# EasyEDA Pro project ProPrj_StarrySkyPi_2025-06-18.epro, board PCB1
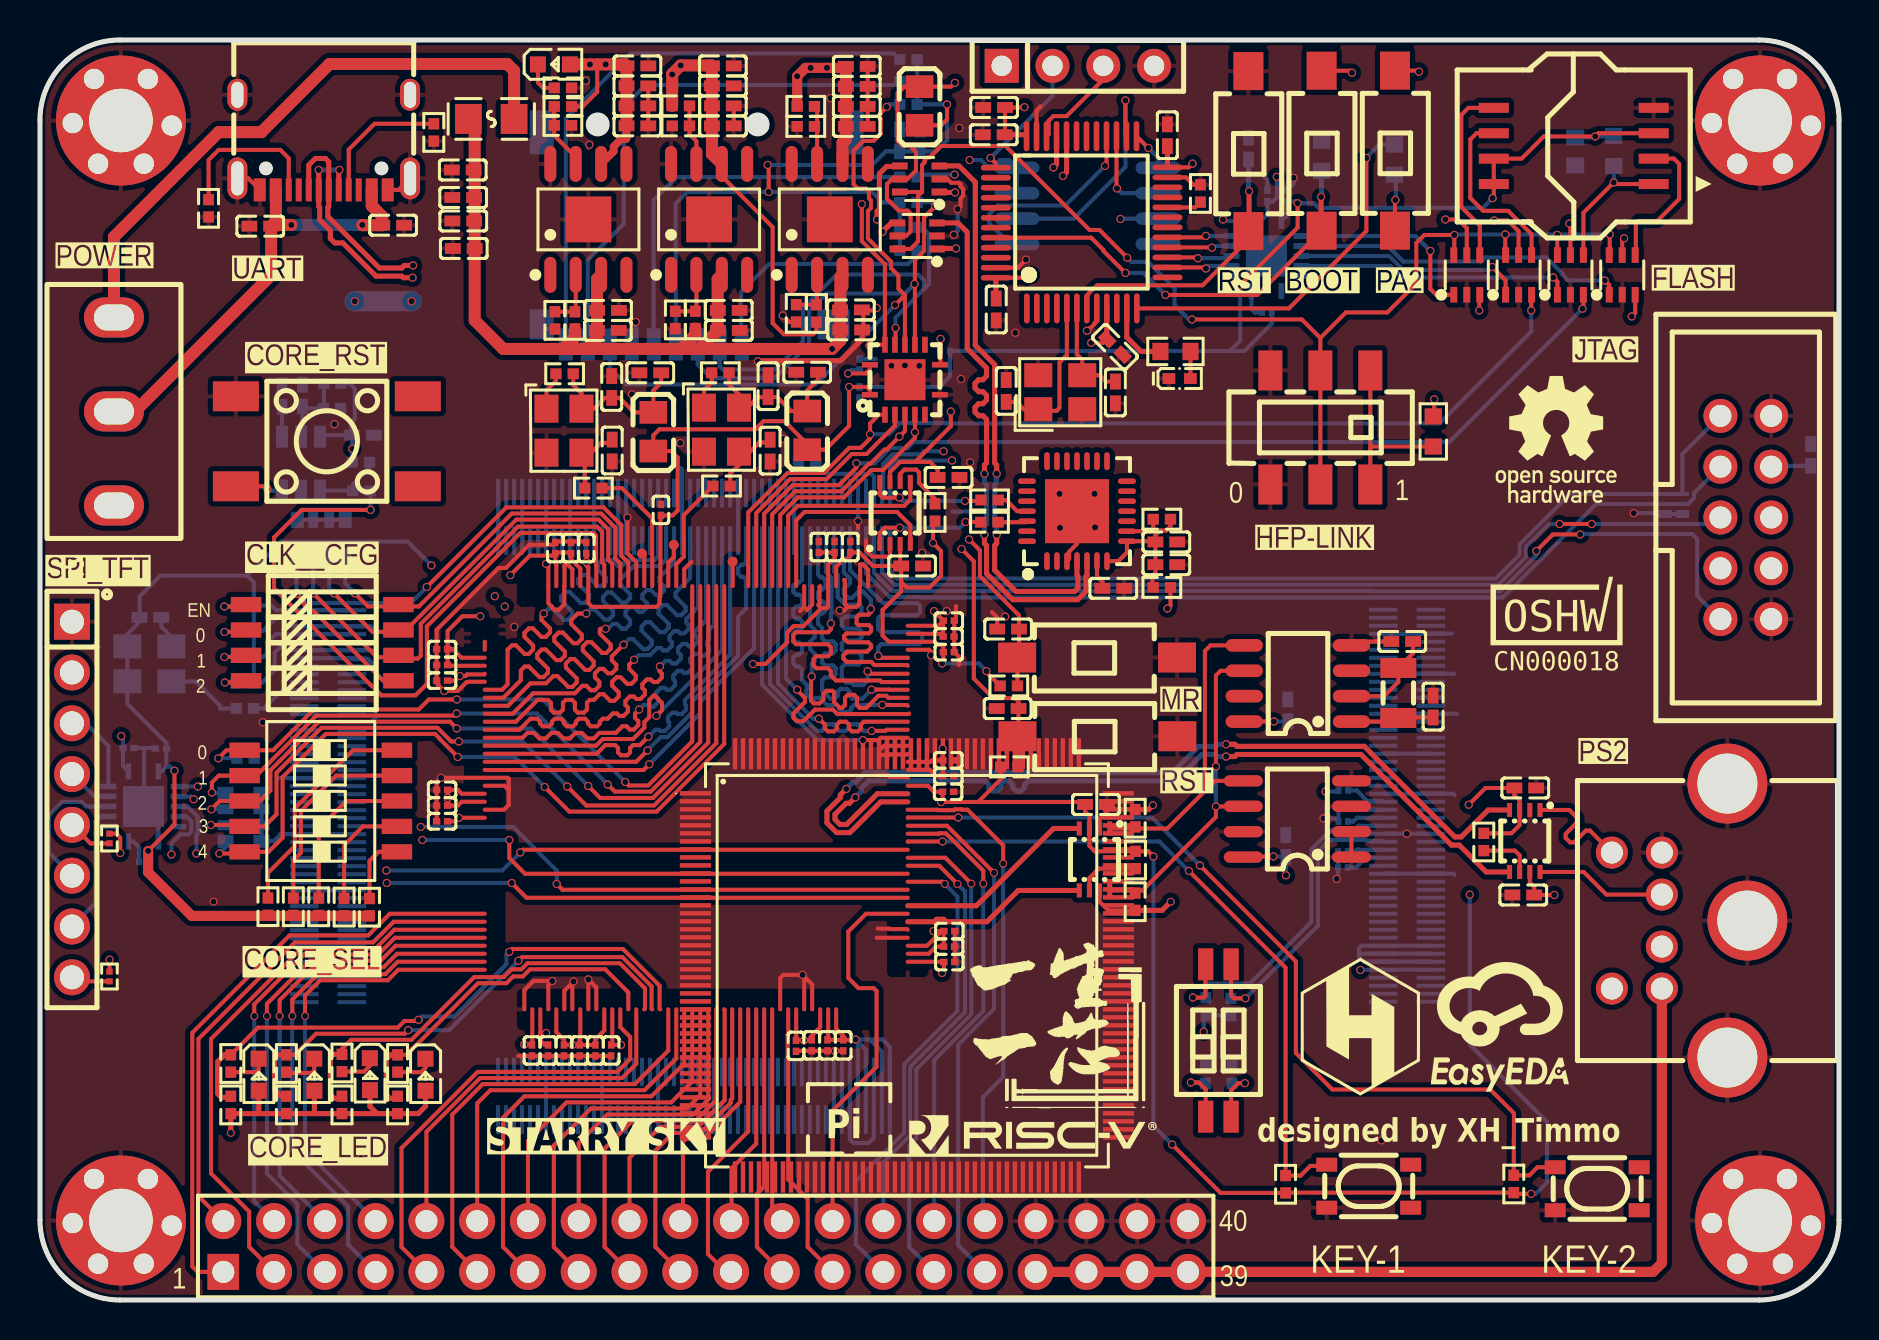
[diagram p7: board, top side]
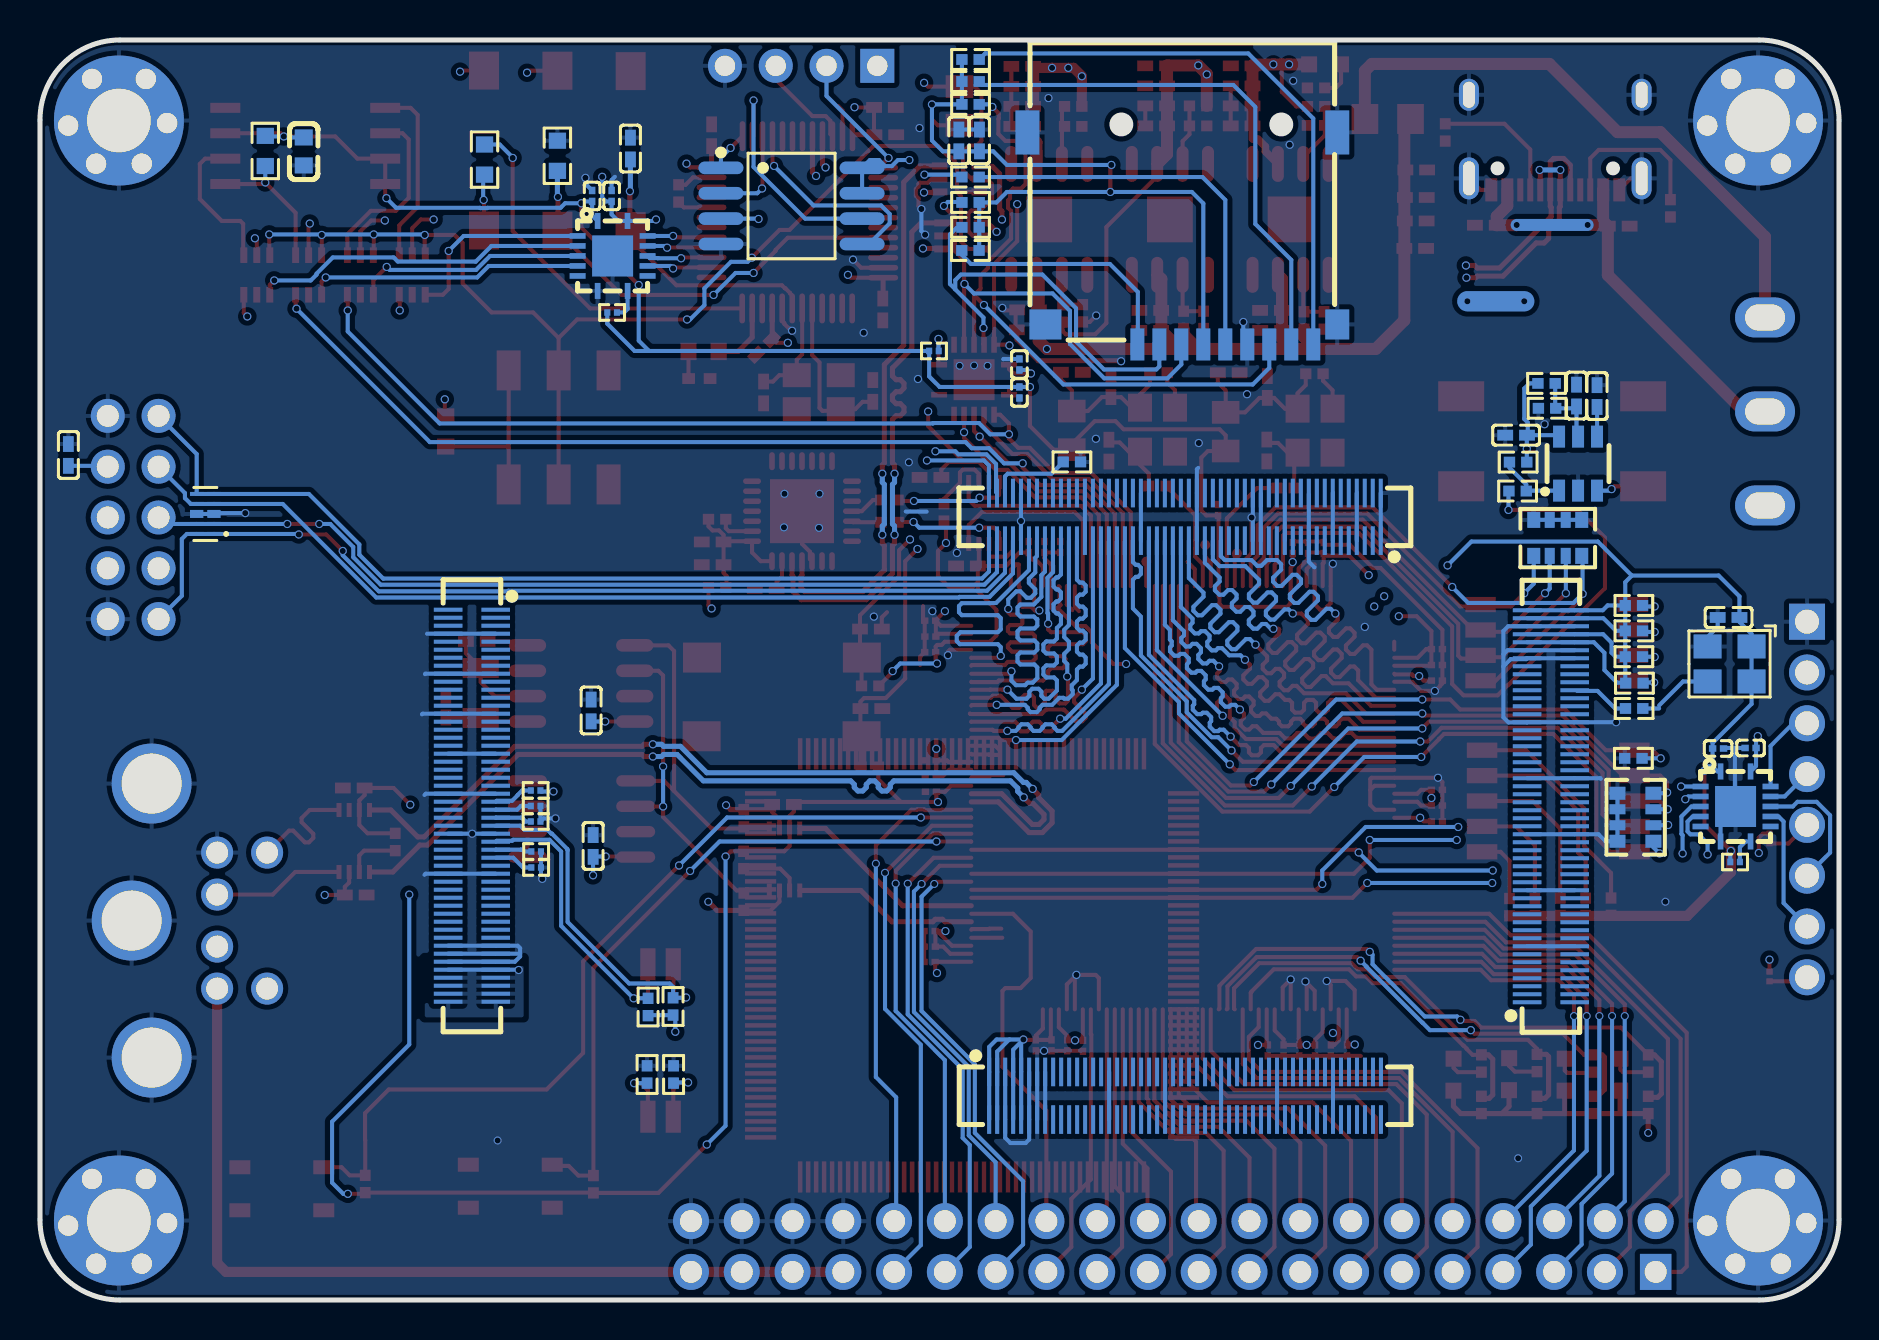
[diagram p8: board, bottom side, seen from below]

Outline 90 x 63 mm; copper layers: Top Layer, Inner2, Inner3, Bottom Layer. Coordinates in mm from the lower left corner of the outline.
Outline path: 0,59 0,4 arc(1.17,1.17) 4,0 86,0 arc(88.83,1.17) 90,4 90,59 arc(88.83,61.83) 86,63 4,63 arc(1.17,61.83) 0,59
Stack: Top Layer 0.035mm / Dielectric1 1.51mm FR4 er 4.5 / Inner2 0.035mm / Dielectric2 0.48mm PP er 4.5 / Inner3 0.035mm / Dielectric3 0.48mm PP er 4.5 / Bottom Layer 0.035mm

## Design rules (mm)
net UD+: DP1
net UD-: DP1
net B35_L23_P: CHIPLINK1
net B35_L21_N: CHIPLINK1
net B35_L21_P: CHIPLINK1
net B35_L19_P: CHIPLINK1
net B35_L20_P: CHIPLINK1
net B35_L19_N: CHIPLINK1
net B35_L1_N: CHIPLINK2
net B35_L2_N: CHIPLINK2
net B35_L25: CHIPLINK2
net FPGA_TMS: JTAG
net FPGA_TDI: JTAG
net FPGA_TDO: JTAG
net FPGA_TCK: JTAG
net B35_L24_N: CHIPLINK1
net B35_L24_P: CHIPLINK1
net B35_L14_N: CHIPLINK1
net B35_L6_P: CHIPLINK2
net B35_L2_P: CHIPLINK2
net B35_L6_N: CHIPLINK2
net B35_L4_P: CHIPLINK2
net B35_L14_P: CHIPLINK1
net B35_L20_N: CHIPLINK1
net B35_L1_P: CHIPLINK2
net B35_L5_N: CHIPLINK2
net B35_L4_N: CHIPLINK2
net B35_L5_P: CHIPLINK2
template: 自定义配置
spacing copperThickness1oz (default): track to track 0.102, other pairs 0.102 to 0.3
spacing copperThickness2oz: track to track 0.203, other pairs 0.152 to 0.3
track width copperThickness1oz (default): min 0.127, default 0.203, max 2.54
track width copperThickness2oz: min 0.203, default 0.254, max 2.54
track width POWER_1A: min 0.305, default 0.305, max 2.54
track width POWER_2A: min 0.508, default 0.508, max 2.54
differential pair differentialPair (default): width min 0.127, default 0.254, max 2.54; gap min 0.152, default 0.152
via viaSize (default): diameter min 0.399, default 0.399, max 10; hole min 0.3, default 0.3, max 6.299

## Placement (name value [footprint] x y rotation side)
C1  100nF  [C0402]  28.6 45.65 90 top
C2  100nF  [C0402]  30.53 46.36 180 top
C3  15pF  [C0402]  28.63 42.48 270 top
C4  100nF  [C0402]  43.63 36.7 0 top
C5  100nF  [C0402]  45.45 41.13 0 top
C6  100nF  [C0402]  40.86 58.68 180 top
C7  100nF  [C0402]  40.86 61.68 180 top
C8  10uF  [C0402]  40.86 59.68 180 top
C9  10uF  [C0402]  40.86 60.68 180 top
C10  100nF  [C0402]  29.89 58.71 180 top
C11  100nF  [C0402]  29.89 61.71 180 top
C12  10uF  [C0402]  29.89 60.71 180 top
C13  10uF  [C0402]  29.89 59.71 180 top
C14  1uF  [C0402]  40.59 48.51 180 top
C15  10uF  [C0402]  40.57 49.51 180 top
C16  1uF  [C0402]  28.42 49.48 180 top
C17  10uF  [C0402]  28.41 48.48 180 top
C18  10uF  [C0402]  17.67 53.74 0 top
C19  10uF  [C0402]  21.2 52.58 0 top
C20  10uF  [C0402]  21.17 55.12 0 top
C21  100nF  [C0402]  21.18 53.95 0 top
C22  100nF  [C0402]  21.15 56.5 0 top
C23  1uF  [C0402]  56.35 37.9 0 top
C24  100nF  [C0402]  56.35 36.77 0 top
C25  100nF  [C0402]  53.69 35.58 0 top
C26  100nF  [C0402]  34.16 61.71 180 top
C27  100nF  [C0402]  34.16 58.71 180 top
C28  10uF  [C0402]  34.16 60.71 180 top
C29  10uF  [C0402]  34.16 59.71 180 top
C30  1uF  [C0402]  34.46 49.48 180 top
C31  10uF  [C0402]  34.46 48.48 180 top
C32  10uF  [C0402]  11.02 53.69 180 top
C33  100nF  [C0402]  38.38 46.39 0 top
C34  100nF  [C0402]  36.42 45.69 270 top
C35  15pF  [C0402]  36.53 42.47 90 top
C36  100nF  [C0201]  45.47 32.39 180 top
C37  100nF  [C0201]  28.58 12.48 90 top
C38  100nF  [C0201]  40.54 37.65 270 top
C39  100nF  [C0201]  39.4 12.73 90 top
C40  100nF  [C0201]  31.06 39.5 270 top
C41  100nF  [C0201]  40.18 12.73 90 top
C42  100nF  [C0201]  20.12 30.97 0 top
C43  100nF  [C0201]  45.49 16.9 180 top
C44  100nF  [C0201]  20.12 23.93 0 top
C45  100nF  [C0201]  45.43 25.41 180 top
C46  100nF  [C0201]  27.33 37.6 270 top
C47  100nF  [C0201]  25.42 12.48 90 top
C48  22nF  [C0402]  12.1 45.2 270 bottom
C49  100nF  [C0402]  16.15 43.24 180 bottom
C50  10nF  [C0402]  13.13 45.22 270 bottom
C51  100nF  [C0201]  45.44 26.19 180 top
C52  100nF  [C0201]  26.21 12.48 90 top
C53  100nF  [C0201]  45.47 33.97 180 top
C54  100nF  [C0201]  20.12 31.75 0 top
C55  100nF  [C0201]  45.46 33.17 180 top
C56  100nF  [C0201]  45.49 18.45 180 top
C57  100nF  [C0201]  39.75 37.65 270 top
C58  100nF  [C0201]  45.48 17.67 180 top
C59  100nF  [C0201]  38.96 37.65 270 top
C60  100nF  [C0201]  38.61 12.73 90 top
C61  100nF  [C0201]  25.78 37.6 270 top
C62  100nF  [C0201]  37.82 12.71 90 top
C63  100nF  [C0201]  27 12.48 90 top
C64  100nF  [C0201]  20.12 25.51 0 top
C65  100nF  [C0201]  24.61 12.48 90 top
C66  100nF  [C0201]  20.12 24.72 0 top
C67  100nF  [C0201]  26.57 37.6 270 top
C68  100nF  [C0201]  27.79 12.48 90 top
C69  100nF  [C0201]  20.12 32.54 0 top
C70  100nF  [C0201]  45.44 26.98 180 top
C74  100nF  [C0603]  76.8 57.43 90 bottom
C84  100nF  [C0402]  48.43 33.55 180 top
C85  100nF  [C0402]  5.53 34.13 0 bottom
C86  100nF  [C0402]  48.41 29.57 180 top
C87  100nF  [C0402]  88.58 42.25 270 bottom
C88  100nF  [C0402]  56.4 58.24 90 top
C89  12pF  [C0402]  53.8 45.38 90 top
C90  12pF  [C0402]  48.34 45.45 270 top
C91  100nF  [C0402]  47.71 58.26 0 top
C93  100nF  [C0402]  53.78 47.65 315 top
C94  100nF  [C0402]  47.84 49.53 270 top
C96  100nF  [C0402]  60.46 57.57 90 bottom
C97  100nF  [C0402]  47.73 59.63 180 top
C100  100nF  [C0402]  43 57.98 90 bottom
C101  10uF  [C0402]  44.03 57.98 90 bottom
C102  100nF  [C0402]  74.3 25.6 180 top
C103  100nF  [C0402]  74.2 20.25 0 top
C104  100nF  [C0402]  62.33 22.7 270 bottom
C105  100nF  [C0402]  62.43 29.48 90 bottom
C106  12pF  [C0402]  69.69 29.67 270 top
C107  12pF  [C0402]  68.15 32.92 0 top
C108  100nF  [C0201]  6.05 27.58 180 bottom
C109  100nF  [C0201]  4.43 27.6 0 bottom
C110  100nF  [C0402]  52.83 24.78 180 top
C111  100nF  [C0201]  62.38 55.2 90 bottom
C112  100nF  [C0201]  61.4 55.2 90 bottom
C113  100nF  [C0201]  41 45.38 270 bottom
C114  100nF  [C0201]  41 46.78 90 bottom
CARD2  XKTF-015-N  [TF-SMD_XKTF-015-N]  32.85 53.08 0 bottom
CN1  GT-B0403FSV14-100B1101  [CONN-SMD_100P-P0.40_GT-B0403FSV24-100B1101]  32.51 38.95 270 bottom
CN2  GT-B0403FSV14-100B1101  [CONN-SMD_100P-P0.40_GT-B0403FSV24-100B1101]  32.93 10.43 90 bottom
CN5  GT-B0403FSV14-100B1101  [CONN-SMD_100P-P0.40_GT-B0403FSV24-100B1101]  14.63 24.48 0 bottom
CN6  GT-B0403FSV14-100B1101  [CONN-SMD_100P-P0.40_GT-B0403FSV24-100B1101]  68.18 24.93 180 bottom
D2  RCLAMP0524P  [DFN2510-10_L2.5-W1.0-P0.50-BL]  81.73 39.3 90 bottom
H1  -  [HDR-TH_4P-P2.54-V-F]  51.92 61.71 0 top
H2  2.54-1*8P母环保  [HDR-TH_8P-P2.54-V-F-1]  1.6 25.03 270 top
L1  CBW201209U601T  [L0805]  30.68 43.42 90 top
L2  CBW201209U601T  [L0805]  38.38 43.48 90 top
L3  CBW201209U601T  [L0805]  44 59.7 90 top
LED1  KT-0603R  [LED0603-RD]  25.71 61.78 0 top
LED4  SZYY0402B  [LED0402-RD_BLUE]  57.01 46.07 0 top
LED9  19-213/Y2C-CQ2R2L/3T(CY)  [LED0603-RD-YELLOW]  19.29 11.27 270 top
LED10  19-213/Y2C-CQ2R2L/3T(CY)  [LED0603-RD-YELLOW]  16.5 11.29 270 top
LED11  19-213/Y2C-CQ2R2L/3T(CY)  [LED0603-RD-YELLOW]  13.72 11.27 270 top
LED12  19-213/Y2C-CQ2R2L/3T(CY)  [LED0603-RD-YELLOW]  10.94 11.27 270 top
OSC1  12.288MHz  [OSC-SMD_4P-L3.2-W2.5-BL]  34.09 43.52 270 top
OSC5  50MHz  [OSC-SMD_4P-L3.2-W2.5-BL]  5.48 31.8 0 bottom
PS1  DS1093-01-PN60  [CONN-TH_DS1093-01-PN60]  82.02 18.97 90 top
R1  4.7kΩ  [R0402]  26.25 46.31 180 top
R2  33Ω  [R0402]  27.69 40.6 0 top
R3  33Ω  [R0402]  34.09 40.7 180 top
R4  4.7kΩ  [R0402]  34.04 46.36 180 top
R5  NC  [R0402]  37.84 49.34 270 top
R6  8.06kΩ  [R0402]  38.31 59.68 0 top
R7  NC  [R0402]  25.76 48.98 270 top
R8  56kΩ  [R0402]  26.16 59.68 180 top
R9  1kΩ  [R0402]  38.84 49.33 270 top
R10  NC  [R0402]  26.76 48.98 270 top
R11  4.7kΩ  [R0402]  44.78 39.38 90 top
R12  10kΩ  [R0402]  38.31 58.68 180 top
R13  10kΩ  [R0402]  26.16 58.73 0 top
R14  0Ω  [R0402]  47.5 38.89 180 top
R15  0Ω  [R0402]  47.51 40 180 top
R16  NC  [R0402]  31.79 49.01 270 top
R17  26.1kΩ  [R0402]  32.06 59.71 0 top
R18  5.1kΩ  [R0402]  8.43 54.58 270 top
R19  NC  [R0402]  32.79 49.01 270 top
R20  10kΩ  [R0402]  32.06 58.71 180 top
R21  5.1kΩ  [R0402]  19.7 58.38 270 top
R22  4.7kΩ  [R0402]  26.16 60.61 180 top
R24  0Ω  [R0402]  56.12 35.63 180 top
R25  4.7kΩ  [R0402]  56.12 39.04 180 top
R26  150Ω  [R0402]  10.26 34.73 0 bottom
R27  150Ω  [R0402]  10.26 33.46 0 bottom
R28  10kΩ  [R0603]  78.73 57.45 90 bottom
R29  150Ω  [R0402]  10.26 32.16 0 bottom
R30  150Ω  [R0402]  10.24 30.84 0 bottom
R31  150Ω  [R0402]  12.67 19.66 270 top
R32  150Ω  [R0402]  13.94 19.66 270 top
R33  150Ω  [R0402]  15.22 19.65 270 top
R34  150Ω  [R0402]  16.48 19.64 270 top
R35  150Ω  [R0402]  11.41 19.67 270 top
R36  10kΩ  [R0402]  10.29 27.08 0 bottom
R37  14kΩ  [R0402]  14.63 45.83 180 bottom
R38  4.7kΩ  [R0402]  16.05 41.89 0 bottom
R39  10kΩ  [R0402]  14.61 44.59 0 bottom
R40  0Ω  [R0402]  16.08 40.45 180 bottom
R125  0Ω  [R0402]  38.38 41.9 180 bottom
R126  33Ω  [R0402]  10.25 29.58 0 bottom
R129  NC  [R0402]  48.47 30.71 180 top
R130  20kΩ  [R0201]  65.2 25.48 0 bottom
R131  20kΩ  [R0201]  65.2 24.7 0 bottom
R132  20kΩ  [R0201]  65.2 23.93 0 bottom
R133  20kΩ  [R0201]  65.18 22.43 0 bottom
R134  20kΩ  [R0201]  65.18 21.63 0 bottom
R135  150Ω  [R0402]  58.33 14.68 270 bottom
R136  150Ω  [R0402]  59.58 14.65 270 bottom
R137  20kΩ  [R0402]  58.3 11.28 90 bottom
R138  20kΩ  [R0402]  59.63 11.28 90 bottom
R148  NC  [R0402]  48.49 26.66 180 top
R153  4.7kΩ  [R0603]  56.8 47.43 180 top
R154  10kΩ  [R0402]  58.05 55.33 270 top
R157  10kΩ  [R0603]  64.11 57.21 270 bottom
R158  330Ω  [R0603]  67.76 57.02 90 bottom
R160  4.7kΩ  [R0603]  69.7 43.43 270 top
R161  33Ω  [R0402]  43.45 56.15 0 bottom
R162  4.7kΩ  [R0402]  43.45 62.03 0 bottom
R163  4.7kΩ  [R0402]  43.45 60.92 0 bottom
R164  4.7kΩ  [R0402]  43.45 59.78 0 bottom
R165  4.7kΩ  [R0402]  43.45 54.88 180 bottom
R166  4.7kΩ  [R0402]  43.45 53.63 180 bottom
R167  4.7kΩ  [R0402]  43.45 52.48 180 bottom
R168  4.7kΩ  [R0402]  72.23 22.9 270 top
R169  4.7kΩ  [R0201]  5.2 21.9 0 bottom
R170  4.7kΩ  [R0402]  54.8 22 270 top
R172  4.7kΩ  [R0402]  73.73 5.8 270 top
R173  4.7kΩ  [R0402]  62.31 5.79 270 top
R174  4.7kΩ  [R0402]  17.89 11.83 270 top
R175  4.7kΩ  [R0402]  15.11 11.85 270 top
R176  4.7kΩ  [R0402]  12.33 11.83 270 top
R177  4.7kΩ  [R0402]  9.55 11.83 270 top
R178  4.7kΩ  [R0201]  3.48 23.08 90 top
R179  4.7kΩ  [R0201]  3.48 16.18 90 top
R180  4.7kΩ  [R0201]  61.38 49.38 0 bottom
R181  4.7kΩ  [R0201]  45.28 47.45 0 bottom
R182  4.7kΩ  [R0402]  17.89 9.75 270 top
R183  4.7kΩ  [R0402]  15.11 9.75 270 top
R184  4.7kΩ  [R0402]  12.33 9.75 270 top
R185  4.7kΩ  [R0402]  9.55 9.75 270 top
R186  4.7kΩ  [R0402]  54.79 24.09 90 top
R187  4.7kΩ  [R0402]  54.79 19.91 270 top
RN1  10kΩ  [RES-ARRAY-SMD_0603-8P-L3.2-W1.6-BL]  14.07 38.11 0 bottom
RN2  10kΩ  [RES-ARRAY-SMD_0603-8P-L3.2-W1.6-BL]  10.19 24.14 270 bottom
S2  M3  [m3 125x300]  4.05 3.97 0 top
S3  M3  [m3 125x300]  4.05 58.97 0 top
S4  M3  [m3 125x300]  86.05 58.97 0 top
S5  M3  [m3 125x300]  86.05 3.97 0 top
SW3  KH-6X6X5H-STM  [SW-SMD_4P-L6.0-W6.0-P4.50-LS9.0-2]  14.35 42.94 0 top
SW5  PTS810SJM250SMTRLFS  [KEY-SMD_4P-L4.2-W3.2-P2.20-LS4.6]  77.9 5.56 180 top
SW9  SS-12D10L5  [SW-TH_SS-12D10L5]  3.7 44.43 90 top
SW12  TS-1101-C-W  [SW-SMD_L6.0-W3.3-LS8.0]  52.88 32.12 0 top
SW13  TS-1101-C-W  [SW-SMD_L6.0-W3.3-LS8.0]  52.9 28.19 0 top
SW14  TS-1101-C-W  [SW-SMD_L6.0-W3.3-LS8.0]  64.11 57.47 90 top
SW15  TS-1101-C-W  [SW-SMD_L6.0-W3.3-LS8.0]  60.45 57.45 90 top
SW16  TS-1101-C-W  [SW-SMD_L6.0-W3.3-LS8.0]  67.79 57.47 90 top
SW17  MST22D18G2 125  [SW-SMD_MST22D18G2]  64.05 43.63 180 top
SW21  DSHP02TS-S  [SW-SMD_DSHP02TS-S]  58.95 12.98 0 top
SW22  PTS810SJM250SMTRLFS  [KEY-SMD_4P-L4.2-W3.2-P2.20-LS4.6]  66.47 5.69 180 top
TP1  -  [Test-Point-0.5mm]  30.12 37.32 0 top
TP2  -  [Test-Point-0.5mm]  31.71 37.76 0 top
TP3  -  [Test-Point-0.5mm]  34.65 36.92 0 top
U1  -  [LQPF 176 20*20]  32.79 25.33 0 top
U2  TXS0102DCUR  [VSON8_L2.0-W2.3-P0.50-LS3.1-BL]  74.28 22.95 180 top
U3  TPS3808G01DBVR  [SOT-23-6_L2.9-W1.6-P0.95-LS2.8-BR]  13.06 41.82 270 bottom
U6  TXS0102DCUR  [VSON8_L2.0-W2.3-P0.50-LS3.1-BL]  42.78 39.35 0 top
U7  RT2515HGSP  [SOP-8_L4.9-W3.9-P1.27-LS6.0-BL-EP]  39.51 54.03 0 top
U8  RT2515HGSP  [SOP-8_L4.9-W3.9-P1.27-LS6.0-BL-EP]  27.44 54.03 0 top
U9  CP2102-GMR  [WQFN-28_L5.0-W5.0-P0.50-BL-EP3.2]  51.88 39.44 0 top
U10  RT2515HGSP  [SOP-8_L4.9-W3.9-P1.27-LS6.0-BL-EP]  33.47 54.03 0 top
U11  SMD0805B050TF  [F0805]  22.58 59.05 180 top
U12  ACA-SPI-004-K02  [CONN-SMD_ACA-SPI-004-K02]  76.73 57.7 270 top
U16  GPHA204-0502A001A1AC  [HDR-TH_10P-P2.54-V-F-R2-C5-S2.54_GREENCONN]  85.34 39.13 270 top
U17  CH32V103C8T6  [LQFP-48_48P-L7.0-W7.0-P0.50-LS9.0-BL]  52.11 53.89 0 top
U18  W25Q128JVSIQ  [SOIC-8_L5.3-W5.3-P1.27-LS8.0-BL]  52.4 54.7 270 bottom
U19  WAS3157B-6/TR  [SOT-363_L2.0-W1.3-P0.65-LS2.1-BL]  76.56 51.25 0 top
U20  WAS3157B-6/TR  [SOT-363_L2.0-W1.3-P0.65-LS2.1-BL]  73.97 51.25 0 top
U21  WAS3157B-6/TR  [SOT-363_L2.0-W1.3-P0.65-LS2.1-BL]  79.15 51.25 0 top
U22  WAS3157B-6/TR  [SOT-363_L2.0-W1.3-P0.65-LS2.1-BL]  71.38 51.25 0 top
U24  WAS3157B-6/TR  [SOT-363_L2.0-W1.3-P0.65-LS2.1-BL]  44 56.05 90 top
U25  WAS3157B-6/TR  [SOT-363_L2.0-W1.3-P0.65-LS2.1-BL]  43.88 53.2 90 top
U26  AT24C64D-SSHM-T  [SOIC-8_L5.0-W4.0-P1.27-LS6.0-BL]  62.9 24.05 90 top
U27  PCF8563BM/TR  [SOP-8_L4.9-W3.9-P1.27-LS6.0-BL]  62.93 30.83 90 top
U29  TXS0102DCUR  [VSON8_L2.0-W2.3-P0.50-LS3.1-BL]  52.75 22.03 180 top
U33  PZ2.54-2*20  [HDR-TH_40P-P2.54-V-M-R2-C20-S2.54]  33.3 2.68 0 top
U34  DSHP05TSGER  [SW-SMD_10P-P1.27-L7.8-W5.4]  14.05 24.95 270 top
U37  TXS0104ERGYR  [VQFN-14_L3.5-W3.5-P0.50-BL-EP]  43.27 46.01 0 top
U38  TXS0104ERGYR  [VQFN-14_L3.5-W3.5-P0.50-BL-EP]  61.35 52.2 270 bottom
U39  TXS0104ERGYR  [VQFN-14_L3.5-W3.5-P0.50-BL-EP]  5.18 24.68 270 bottom
U40  DSHP04TSGER  [SW-SMD_8P-L6.7-W5.4-P1.27-LS8.4]  14.12 32.87 270 top
UART1  -  [USB-C-SMD_G-SWITCH_GT-USB-7010EN]  14.19 57.88 180 top
X1  25MHz  [OSC-SMD_4P-L3.2-W2.5-BL]  26.21 43.47 270 top
X2  8MHz  [CRYSTAL-SMD_4P-L3.2-W2.5-BL]  51.04 45.39 0 top
X3  32.768kHz  [FC-135R_L3.2-W1.5]  67.95 30.35 270 top

## Footprints (pads in the part's own frame, mm; a bottom-side part is the same pattern mirrored in y, then rotated)
C0201
  rect 0.368x0.324 smd: 1(-0.275,0) 2(0.275,0)
C0402
  rect 0.79x0.54 smd: 1(-0.545,0) 2(0.545,0)
C0603
  rect 0.8x0.9 smd: 1(-0.7,0) 2(0.7,0)
CONN-SMD_100P-P0.40_GT-B0403FSV24-100B1101
  rect 1.43x0.2 smd: 1(0.978,9.588) 2(0.978,9.188) 3(0.978,8.787) 4(0.978,8.388) 5(0.978,7.988) 6(0.978,7.588) 7(0.978,7.188) 8(0.978,6.787) 9(0.978,6.388) 10(0.978,5.987) 11(0.978,5.588) 12(0.978,5.188) 13(0.978,4.787) 14(0.978,4.388) 15(0.978,3.988) 16(0.978,3.587) 17(0.978,3.188) 18(0.978,2.788) 19(0.978,2.388) 20(0.978,1.988) 21(0.978,1.587) 22(0.978,1.188) 23(0.978,0.787) 24(0.978,0.388) 25(0.978,-0.012) 26(0.978,-0.412) 27(0.978,-0.812) 28(0.978,-1.212) 29(0.978,-1.612) 30(0.978,-2.012) 31(0.978,-2.413) 32(0.978,-2.812) 33(0.978,-3.212) 34(0.978,-3.612) 35(0.978,-4.012) 36(0.978,-4.412) 37(0.978,-4.812) 38(0.978,-5.213) 39(0.978,-5.612) 40(0.978,-6.012) 41(0.978,-6.412) 42(0.978,-6.812) 43(0.978,-7.213) 44(0.978,-7.612) 45(0.978,-8.012) 46(0.978,-8.412) 47(0.978,-8.812) 48(0.978,-9.213) 49(0.978,-9.612) 50(0.978,-10.012) 51(-1.403,-10.012) 52(-1.403,-9.612) 53(-1.403,-9.213) 54(-1.403,-8.812) 55(-1.403,-8.412) 56(-1.403,-8.012) 57(-1.403,-7.612) 58(-1.403,-7.213) 59(-1.403,-6.812) 60(-1.403,-6.412) 61(-1.403,-6.012) 62(-1.403,-5.612) 63(-1.403,-5.213) 64(-1.403,-4.812) 65(-1.403,-4.412) 66(-1.403,-4.012) 67(-1.403,-3.612) 68(-1.403,-3.212) 69(-1.403,-2.812) 70(-1.403,-2.413) 71(-1.403,-2.012) 72(-1.403,-1.612) 73(-1.403,-1.212) 74(-1.403,-0.812) 75(-1.403,-0.412) 76(-1.403,-0.012) 77(-1.403,0.388) 78(-1.403,0.787) 79(-1.403,1.188) 80(-1.403,1.587) 81(-1.403,1.988) 82(-1.403,2.388) 83(-1.403,2.788) 84(-1.403,3.188) 85(-1.403,3.587) 86(-1.403,3.988) 87(-1.403,4.388) 88(-1.403,4.787) 89(-1.403,5.188) 90(-1.403,5.588) 91(-1.403,5.988) 92(-1.403,6.388) 93(-1.403,6.787) 94(-1.403,7.188) 95(-1.403,7.588) 96(-1.403,7.988) 97(-1.403,8.388) 98(-1.403,8.787) 99(-1.403,9.188) 100(-1.403,9.588)
CONN-SMD_ACA-SPI-004-K02
  rect 0.5x1.5 smd: 1(1.905,4) 2(0.635,4) 3(-0.635,4) 4(-1.905,4) 5(-1.905,-4) 6(-0.635,-4) 7(0.635,-4) 8(1.905,-4)
CONN-TH_DS1093-01-PN60
  round 1.6 hole 1.1: 1(1.3,0.888) 2(-1.3,0.888) 3(3.4,0.888) 4(-3.4,0.888) 5(3.4,3.388) 6(-3.4,3.388)
  round 4 hole 3: 7(0,-3.388) 8(-6.85,-2.39) 9(6.85,-2.39)
CRYSTAL-SMD_4P-L3.2-W2.5-BL
  rect 1.4x1.2 smd: 1(-1.1,-0.85) 2(1.1,-0.85) 3(1.1,0.85) 4(-1.1,0.85)
DFN2510-10_L2.5-W1.0-P0.50-BL
  rect 0.2x0.665 smd: 1(-1,-0.433) 2(-0.5,-0.433) 4(0.5,-0.433) 5(1,-0.433) 6(1,0.433) 7(0.5,0.433) 9(-0.5,0.433) 10(-1,0.433)
  rect 0.4x0.665 smd: 3(0,-0.433) 8(0,0.433)
F0805
  rect 1.335x1.5 smd: 1(-1.143,0) 2(1.143,0)
FC-135R_L3.2-W1.5
  rect 1x1.8 smd: 1(-1.25,0) 2(1.25,0)
HDR-TH_4P-P2.54-V-F
  rect 1.7x1.7 hole 1.02: 1(-3.81,0)
  round 1.7 hole 1.02: 2(-1.27,0) 3(1.27,0) 4(3.81,0)
HDR-TH_8P-P2.54-V-F-1
  rect 1.8x1.8 hole 1.2: 1(-8.89,0)
  round 1.8 hole 1.2: 2(-6.35,0) 3(-3.81,0) 4(-1.27,0) 5(1.27,0) 6(3.81,0) 7(6.35,0) 8(8.89,0)
HDR-TH_10P-P2.54-V-F-R2-C5-S2.54_GREENCONN
  round 1.7 hole 1.1: 1(-5.08,-1.27) 2(-5.08,1.27) 3(-2.54,-1.27) 4(-2.54,1.27) 5(0,-1.27) 6(0,1.27) 7(2.54,-1.27) 8(2.54,1.27) 9(5.08,-1.27) 10(5.08,1.27)
HDR-TH_40P-P2.54-V-M-R2-C20-S2.54
  rect 1.575x1.8 hole 1.1: 1(-24.13,-1.27)
  round 1.8 hole 1.1: 2(-24.13,1.27) 3(-21.59,-1.27) 4(-21.59,1.27) 5(-19.05,-1.27) 6(-19.05,1.27) 7(-16.51,-1.27) 8(-16.51,1.27) 9(-13.97,-1.27) 10(-13.97,1.27) 11(-11.43,-1.27) 12(-11.43,1.27) 13(-8.89,-1.27) 14(-8.89,1.27) 15(-6.35,-1.27) 16(-6.35,1.27) 17(-3.81,-1.27) 18(-3.81,1.27) 19(-1.27,-1.27) 20(-1.27,1.27) 21(1.27,-1.27) 22(1.27,1.27) 23(3.81,-1.27) 24(3.81,1.27) 25(6.35,-1.27) 26(6.35,1.27) 27(8.89,-1.27) 28(8.89,1.27) 29(11.43,-1.27) 30(11.43,1.27) 31(13.97,-1.27) 32(13.97,1.27) 33(16.51,-1.27) 34(16.51,1.27) 35(19.05,-1.27) 36(19.05,1.27) 37(21.59,-1.27) 38(21.59,1.27) 39(24.13,-1.27) 40(24.13,1.27)
KEY-SMD_4P-L4.2-W3.2-P2.20-LS4.6
  rect 1.05x0.7 smd: 1(-2.1,1.075) 2(2.1,1.075) 3(-2.1,-1.075) 4(2.1,-1.075)
L0805
  rect 1.133x1.377 smd: 1(-0.966,0) 2(0.966,0)
LED0402-RD_BLUE
  rect 0.636x0.54 smd: 1(-0.538,0) 2(0.538,0)
LED0603-RD
  rect 0.8x0.8 smd: 1(-0.799,0) 2(0.799,0)
LED0603-RD-YELLOW
  rect 0.8x0.8 smd: 1(-0.799,-0.004) 2(0.799,0.004)
LQFP-48_48P-L7.0-W7.0-P0.50-LS9.0-BL
  oval 0.28x1.5 smd: 1(-2.743,-4.306) 2(-2.243,-4.306) 3(-1.742,-4.306) 4(-1.242,-4.306) 5(-0.742,-4.306) 6(-0.241,-4.306) 7(0.257,-4.306) 8(0.757,-4.306) 9(1.258,-4.306) 10(1.758,-4.306) 11(2.258,-4.306) 12(2.759,-4.306) 25(2.743,4.306) 26(2.243,4.306) 27(1.742,4.306) 28(1.242,4.306) 29(0.742,4.306) 30(0.241,4.306) 31(-0.257,4.306) 32(-0.757,4.306) 33(-1.258,4.306) 34(-1.758,4.306) 35(-2.258,4.306) 36(-2.759,4.306)
  oval 1.5x0.28 smd: 13(4.293,-2.756) 14(4.293,-2.256) 15(4.293,-1.755) 16(4.293,-1.255) 17(4.293,-0.754) 18(4.293,-0.254) 19(4.293,0.244) 20(4.293,0.744) 21(4.293,1.244) 22(4.293,1.745) 23(4.293,2.245) 24(4.293,2.745) 37(-4.293,2.731) 38(-4.293,2.23) 39(-4.293,1.73) 40(-4.293,1.23) 41(-4.293,0.729) 42(-4.293,0.229) 43(-4.293,-0.269) 44(-4.293,-0.769) 45(-4.293,-1.27) 46(-4.293,-1.77) 47(-4.293,-2.271) 48(-4.293,-2.771)
LQPF 176 20*20
  rect 1.56x0.224 smd: 1(0,0) 2(0,-0.4) 3(0,-0.8) 4(0,-1.2) 5(0,-1.6) 6(0,-2) 7(0,-2.4) 8(0,-2.8) 9(0,-3.2) 10(0,-3.6) 11(0,-4) 12(0,-4.4) 13(0,-4.8) 14(0,-5.2) 15(0,-5.6) 16(0,-6) 17(0,-6.4) 18(0,-6.8) 19(0,-7.2) 20(0,-7.6) 21(0,-8) 22(0,-8.4) 23(0,-8.8) 24(0,-9.2) 25(0,-9.6) 26(0,-10) 27(0,-10.4) 28(0,-10.8) 29(0,-11.2) 30(0,-11.6) 31(0,-12) 32(0,-12.4) 33(0,-12.8) 34(0,-13.2) 35(0,-13.6) 36(0,-14) 37(0,-14.4) 38(0,-14.8) 39(0,-15.2) 40(0,-15.6) 41(0,-16) 42(0,-16.4) 43(0,-16.8) 44(0,-17.2) 89(21.16,-17.2) 90(21.16,-16.8) 91(21.16,-16.4) 92(21.16,-16) 93(21.16,-15.6) 94(21.16,-15.2) 95(21.16,-14.8) 96(21.16,-14.4) 97(21.16,-14) 98(21.16,-13.6) 99(21.16,-13.2) 100(21.16,-12.8) 101(21.16,-12.4) 102(21.16,-12) 103(21.16,-11.6) 104(21.16,-11.2) 105(21.16,-10.8) 106(21.16,-10.4) 107(21.16,-10) 108(21.16,-9.6) 109(21.16,-9.2) 110(21.16,-8.8) 111(21.16,-8.4) 112(21.16,-8) 113(21.16,-7.6) 114(21.16,-7.2) 115(21.16,-6.8) 116(21.16,-6.4) 117(21.16,-6) 118(21.16,-5.6) 119(21.16,-5.2) 120(21.16,-4.8) 121(21.16,-4.4) 122(21.16,-4) 123(21.16,-3.6) 124(21.16,-3.2) 125(21.16,-2.8) 126(21.16,-2.4) 127(21.16,-2) 128(21.16,-1.6) 129(21.16,-1.2) 130(21.16,-0.8) 131(21.16,-0.4) 132(21.16,0)
  rect 0.224x1.56 smd: 45(1.98,-19.18) 46(2.38,-19.18) 47(2.78,-19.18) 48(3.18,-19.18) 49(3.58,-19.18) 50(3.98,-19.18) 51(4.38,-19.18) 52(4.78,-19.18) 53(5.18,-19.18) 54(5.58,-19.18) 55(5.98,-19.18) 56(6.38,-19.18) 57(6.78,-19.18) 58(7.18,-19.18) 59(7.58,-19.18) 60(7.98,-19.18) 61(8.38,-19.18) 62(8.78,-19.18) 63(9.18,-19.18) 64(9.58,-19.18) 65(9.98,-19.18) 66(10.38,-19.18) 67(10.78,-19.18) 68(11.18,-19.18) 69(11.58,-19.18) 70(11.98,-19.18) 71(12.38,-19.18) 72(12.78,-19.18) 73(13.18,-19.18) 74(13.58,-19.18) 75(13.98,-19.18) 76(14.38,-19.18) 77(14.78,-19.18) 78(15.18,-19.18) 79(15.58,-19.18) 80(15.98,-19.18) 81(16.38,-19.18) 82(16.78,-19.18) 83(17.18,-19.18) 84(17.58,-19.18) 85(17.98,-19.18) 86(18.38,-19.18) 87(18.78,-19.18) 88(19.18,-19.18) 133(19.18,1.98) 134(18.78,1.98) 135(18.38,1.98) 136(17.98,1.98) 137(17.58,1.98) 138(17.18,1.98) 139(16.78,1.98) 140(16.38,1.98) 141(15.98,1.98) 142(15.58,1.98) 143(15.18,1.98) 144(14.78,1.98) 145(14.38,1.98) 146(13.98,1.98) 147(13.58,1.98) 148(13.18,1.98) 149(12.78,1.98) 150(12.38,1.98) 151(11.98,1.98) 152(11.58,1.98) 153(11.18,1.98) 154(10.78,1.98) 155(10.38,1.98) 156(9.98,1.98) 157(9.58,1.98) 158(9.18,1.98) 159(8.78,1.98) 160(8.38,1.98) 161(7.98,1.98) 162(7.58,1.98) 163(7.18,1.98) 164(6.78,1.98) 165(6.38,1.98) 166(5.98,1.98) 167(5.58,1.98) 168(5.18,1.98) 169(4.78,1.98) 170(4.38,1.98) 171(3.98,1.98) 172(3.58,1.98) 173(3.18,1.98) 174(2.78,1.98) 175(2.38,1.98) 176(1.98,1.98)
m3 125x300
  round 1.016 hole 1.021x1.016: 1(-2.413,-0.127) 1(-1.346,2.078) 1(-1.143,-2.159) 1(1.143,-2.159) 1(1.346,2.078) 1(2.54,-0.254)
  round 6.5 hole 3.18x3.175: 1(0,0)
OSC-SMD_4P-L3.2-W2.5-BL
  rect 1.4x1.2 smd: 1(-1.1,-0.875) 2(1.1,-0.875) 3(1.1,0.875) 4(-1.1,0.875)
R0201
  rect 0.303x0.324 smd: 1(-0.241,0) 2(0.241,0)
R0402
  rect 0.566x0.54 smd: 1(-0.433,0) 2(0.433,0)
R0603
  rect 0.806x0.864 smd: 1(-0.753,0) 2(0.753,0)
RES-ARRAY-SMD_0603-8P-L3.2-W1.6-BL
  rect 0.65x0.8 smd: 1(-1.2,-0.9) 4(1.2,-0.9) 5(1.2,0.9) 8(-1.2,0.9)
  rect 0.5x0.8 smd: 2(-0.4,-0.9) 3(0.4,-0.9) 6(0.4,0.9) 7(-0.4,0.9)
SOIC-8_L5.0-W4.0-P1.27-LS6.0-BL
  oval 0.569x1.95 smd: 1(-1.905,-2.705) 2(-0.635,-2.705) 3(0.635,-2.705) 4(1.905,-2.705) 5(1.905,2.705) 6(0.635,2.705) 7(-0.635,2.705) 8(-1.905,2.705)
SOIC-8_L5.3-W5.3-P1.27-LS8.0-BL
  oval 0.63x2.25 smd: 1(-1.905,-3.53) 2(-0.635,-3.53) 3(0.635,-3.53) 4(1.905,-3.53) 5(1.905,3.53) 6(0.635,3.53) 7(-0.635,3.53) 8(-1.905,3.53)
SOP-8_L4.9-W3.9-P1.27-LS6.0-BL
  oval 0.63x1.865 smd: 1(-1.905,-2.683) 2(-0.635,-2.683) 3(0.635,-2.683) 4(1.905,-2.683) 5(1.905,2.683) 6(0.635,2.683) 7(-0.635,2.683) 8(-1.905,2.683)
SOP-8_L4.9-W3.9-P1.27-LS6.0-BL-EP
  oval 0.6x1.8 smd: 1(-1.905,-2.772) 2(-0.635,-2.772) 3(0.635,-2.772) 4(1.905,-2.772) 5(1.905,2.772) 6(0.635,2.772) 7(-0.635,2.772) 8(-1.905,2.772)
  rect 2.29x2.29 smd: 9(0,0)
SOT-23-6_L2.9-W1.6-P0.95-LS2.8-BR
  rect 1.1x0.6 smd: 1(1.35,-0.95) 2(1.35,0) 3(1.35,0.95) 4(-1.35,0.95) 5(-1.35,0) 6(-1.35,-0.95)
SOT-363_L2.0-W1.3-P0.65-LS2.1-BL
  rect 0.35x0.78 smd: 1(-0.65,-0.99) 2(0,-0.99) 3(0.65,-0.99) 4(0.65,0.99) 5(0,0.99) 6(-0.65,0.99)
SW-SMD_4P-L6.0-W6.0-P4.50-LS9.0-2
  rect 2.3x1.5 smd: 1(-4.55,2.25) 2(4.55,2.25) 3(-4.55,-2.25) 4(4.55,-2.25)
SW-SMD_8P-L6.7-W5.4-P1.27-LS8.4
  rect 0.762x1.524 smd: 1(-1.905,-3.81) 2(-0.635,-3.81) 3(0.635,-3.81) 4(1.905,-3.81) 5(1.905,3.81) 6(0.635,3.81) 7(-0.635,3.81) 8(-1.905,3.81)
SW-SMD_10P-P1.27-L7.8-W5.4
  rect 0.762x1.524 smd: 1(-2.54,-3.81) 2(-1.27,-3.81) 3(0,-3.81) 4(1.27,-3.81) 5(2.54,-3.81) 6(2.54,3.81) 7(1.27,3.81) 8(0,3.81) 9(-1.27,3.81) 10(-2.54,3.81)
SW-SMD_DSHP02TS-S
  rect 0.762x1.6 smd: 1(0.635,3.81) 2(-0.635,3.81) 3(-0.635,-3.81) 4(0.635,-3.81)
SW-SMD_L6.0-W3.3-LS8.0
  rect 1.9x1.5 smd: 1(-4,0) 2(4,0)
SW-SMD_MST22D18G2
  rect 1.2x2 smd: 1(-2.5,2.85) 2(0,2.85) 3(2.5,2.85) 4(-2.5,-2.85) 5(0,-2.85) 6(2.5,-2.85)
SW-TH_SS-12D10L5
  oval 2x3 hole 1.3x2: 1(-4.7,0) 2(0,0) 3(4.7,0)
Test-Point-0.5mm
  round 0.5 smd: 1(0,0)
TF-SMD_XKTF-015-N
  rect 0.7x1.6 smd: 1(2.25,5.3) 2(1.15,5.3) 3(0.05,5.3) 4(-1.05,5.3) 5(-2.15,5.3) 6(-3.25,5.3) 7(-4.35,5.3) 8(-5.45,5.3) 9(-6.55,5.3)
  rect 1.2x1.5 smd: 10(-7.75,4.3)
  rect 1.2x2.2 smd: 11(-7.75,-5.3) 13(7.75,-5.3)
  rect 1.6x1.5 smd: 12(6.85,4.3)
USB-C-SMD_G-SWITCH_GT-USB-7010EN
  oval 1x2.1 hole 0.6x1.7: 1(-4.32,1.802) 2(4.32,1.802)
  oval 1x1.6 hole 0.6x1.3: 3(4.32,-2.377) 4(-4.32,-2.377)
  rect 0.6x1.15 smd: A1B12(-3.2,2.377) A4B9(-2.4,2.377) B1A12(3.2,2.377) B4A9(2.4,2.377)
  rect 0.3x1.15 smd: A5(-1.25,2.377) A6(-0.25,2.377) A7(0.25,2.377) A8(1.25,2.377) B5(1.75,2.377) B6(0.75,2.377) B7(-0.75,2.377) B8(-1.75,2.377)
VQFN-14_L3.5-W3.5-P0.50-BL-EP
  rect 0.8x0.28 smd: 1(-1.75,-0.75) 7(1.75,-0.75) 8(1.75,0.75) 14(-1.75,0.75)
  rect 0.28x0.8 smd: 2(-0.999,-1.75) 3(-0.498,-1.75) 4(0.002,-1.75) 5(0.501,-1.75) 6(1.002,-1.75) 9(1,1.75) 10(0.5,1.75) 11(0,1.75) 12(-0.5,1.75) 13(-1,1.75)
  rect 2.05x2.05 smd: 15(0,0)
VSON8_L2.0-W2.3-P0.50-LS3.1-BL
  rect 0.25x0.7 smd: 1(-0.762,-1.55) 2(-0.254,-1.55) 3(0.254,-1.55) 4(0.762,-1.55) 5(0.762,1.55) 6(0.254,1.55) 7(-0.254,1.55) 8(-0.762,1.55)
WQFN-28_L5.0-W5.0-P0.50-BL-EP3.2
  oval 0.28x0.9 smd: 1(-1.502,-2.5) 2(-1.001,-2.5) 3(-0.5,-2.5) 4(0,-2.5) 5(0.5,-2.5) 6(1,-2.5) 7(1.501,-2.5) 15(1.501,2.5) 16(1,2.5) 17(0.5,2.5) 18(0,2.5) 19(-0.5,2.5) 20(-1.001,2.5) 21(-1.502,2.5)
  oval 0.9x0.28 smd: 8(2.5,-1.502) 9(2.5,-1.001) 10(2.5,-0.5) 11(2.5,0) 12(2.5,0.5) 13(2.5,1) 14(2.5,1.501) 22(-2.5,1.501) 23(-2.5,1) 24(-2.5,0.5) 25(-2.5,0) 26(-2.5,-0.5) 27(-2.5,-1.001) 28(-2.5,-1.502)
  rect 3.2x3.2 smd: 29(0,0)

## Nets
As in the schematic.

Pads without a net: CN1 2 3 5 6 8 9 11 12 14 15 18 19 20 54 56 57 58 59 60 61 62 64 65 66 67 68 69 71 72 73 74 75 76 78 79 80 81 82 83 86 87 89 90 92 93 95 96 98 99; CN2 9 10 11 12 13 14 15 17 18 19 20 21 22 24 25 26 27 28 29 31 32 33 34 35 36 38 39 40 41 42 43 45 46 47 48 49 50 51 52 53 54 55 56 58 59 60 61 62 63 65 66 67 68 69 70 72 73 76 77 79 80 81 82 83 84 86 87 88 89 90 91 92; CN5 1 2 3 4 5 6 7 9 10 11 12 13 14 16 17 18 19 20 21 23 24 25 26 27 28 30 31 32 33 34 35 37 38 39 40 41 42 43 58 59 60 62 63 64 66 67 68 69 70 71 73 74 75 76 77 78 80 81 82 83 84 85 87 88 89 90 91 92 94 95 96 97 98 99 100; CN6 1 2 3 5 6 7 8 10 11 12 13 15 16 17 18 20 21 22 23 33 35 36 37 38 39 40 41 42 59 60 61 62 63 64 65 66 68 69 70 71 73 74 75 76 78 79 80 81 83 84 85 86 88 89 90 91 93 94 95 96 98 99 100; PS1 2 6; SW3 2 4; SW5 1 3; SW9 1; SW22 1 3; U1 85 86 87 88 135 149 174 175 176; U7 1 4 5; U8 1 4 5; U9 1 2 10 11 12 13 14 15 16 17 18 19 20 21 22 23 24 27 28; U10 1 4 5; U16 6 7 8; U17 1 2 3 4 10 13 18 19 21 22 29 30 31 38 39 40 41 42 43 45 46; U27 3 7; U37 6 9; U38 6 9; U39 6 9; UART1 A8 B8

## Via types
v1: diameter 0.41, hole 0.305, Top Layer to Bottom Layer, 178 vias
v2: diameter 0.409, hole 0.305, Top Layer to Bottom Layer, 94 vias
v3: diameter 0.399, hole 0.299, Top Layer to Bottom Layer, 21 vias

## Routing (per net, layer and track width the routed paths; a pad name or vN(x,y) marks a point on that pad's centre or on a via; arc(x,y) is an arc through that point)
3V3_HFP_SPI1_CLK: length 3.3
  Top Layer w0.203: U17.15 57.89,52.13 v1(57.93,52.09)
  Bottom Layer w0.203: U38.11 59.5,52.1 59.1,52.1 59.09,52.09 v1(57.93,52.09)
3V3_HFP_SPI1_CS: length 3.3
  Top Layer w0.203: v1(58.33,51.58) 58.28,51.63 U17.14
  Bottom Layer w0.203: U38.10 58.45,51.7 v1(58.33,51.58)
3V3_HFP_SPI1_MISO: length 3.2
  Top Layer w0.203: U17.16 58.61,52.63 v1(58.63,52.62)
  Bottom Layer w0.203: v1(58.63,52.62) 58.71,52.7 U38.12
3V3_HFP_SPI1_MOSI: length 3.2
  Top Layer w0.203: v1(58.33,53.2) 58.26,53.13 U17.17
  Bottom Layer w0.203: v1(58.33,53.2) U38.13
3V3_HFP_SPI2_CLK: length 11.6
  Top Layer w0.203: v1(54.3,59.98) 54.3,58.24 U17.26
  Bottom Layer w0.203: v1(54.3,59.98) 54.3,56.65 51.72,54.07 48.87,54.07
3V3_HFP_SPI2_CS: length 2
  Top Layer w0.203: U17.25 55.44,57.6 v1(55.45,57.6)
  Bottom Layer w0.203: v1(55.45,57.6) 55.93,57.12 U18.1
3V3_HFP_SPI2_MISO: length 4.8
  Top Layer w0.203: U17.27 53.86,55.6 v1(53.88,55.58)
  Bottom Layer w0.203: U18.2 54.12,55.34 v1(53.88,55.58)
3V3_HFP_SPI2_MOSI: length 10.6
  Top Layer w0.203: U17.28 53.36,56.78 v1(53.28,56.7)
  Bottom Layer w0.203: v1(53.28,56.7) 51.3,54.73 47.92,54.73 47.49,54.3 47.49,53.83 48.33,53 48.67,53 48.87,52.8
3V3_HFP_USB_DN: length 9.9
  Top Layer w0.254: U25.1 44.9,52.58 v1(45.83,52.58) ; v1(51.18,56.2) 51.36,56.38 U17.32
  Inner2 w0.254: v1(51.18,56.2) 47.55,52.58 v1(45.83,52.58)
3V3_HFP_USB_DP: length 10.1
  Top Layer w0.254: v1(50.7,56.63) 50.86,56.78 U17.33 ; 44.9,55.4 44.92,55.38 v1(45.78,55.38)
  Inner2 w0.254: v1(45.78,55.38) 47.92,55.38 48.1,55.2 48.1,54.3 48.28,54.12 48.52,54.12 48.7,54.3 48.7,55.2 48.88,55.38 49.45,55.38 v1(50.7,56.63)
3V3_I2C_SCL: length 16.8
  Top Layer w0.203: U27.6 59.06,31.46 58.83,31.23 v1(58.83,26.68) ; U26.6 60.19,24.68 v1(58.83,24.68) 58.83,24.15 55.15,20.48 U29.8
  Bottom Layer w0.203: v1(58.83,26.68) v1(58.83,24.68)
3V3_I2C_SDA: length 16.8
  Top Layer w0.203: 58.28,25.45 58.28,32.45 58.56,32.73 U27.5 ; 58.28,25.45 56.4,23.58 U29.1 ; 58.28,25.45 58.78,25.96 U26.5
3V3_RXD: length 5.8
  Top Layer w0.203: v1(43.02,38.62) 42.27,38.62 42.02,38.36 U6.1 ; R14.2 47.05,38.9 v1(46.3,38.9)
  Bottom Layer w0.203: v1(46.3,38.9) 46.02,38.62 v1(43.02,38.62)
3V3_SOC_FLASH_CLK: length 15.5
  Top Layer w0.203: v1(41.11,54.79) 41.11,52.94 42.27,51.79 U37.13 41.54,47.76 v1(41.5,47.73)
  Inner2 w0.203: v1(45.75,56.27) 42.59,56.27 v1(41.11,54.79)
  Bottom Layer w0.203: v1(45.75,56.27) 44,56.27 R161.2
3V3_SOC_FLASH_CS1: length 21.6
  Top Layer w0.203: U37.12 42.8,47.8 v1(42.8,48.6)
  Bottom Layer w0.203: 44.15,53.6 44.48,53.28 44.48,50.8 44.21,50.54 ; CARD2.2 34,46.68 34.15,46.53 36.77,46.53 38.17,47.93 38.17,49.59 39.85,51.27 43.93,51.27 44.21,50.99 44.21,50.54 ; 44.21,50.54 42.8,49.13 v1(42.8,48.6)
3V3_SOC_FLASH_MISO: length 33.2
  Top Layer w0.203: 43.27,50.24 42.95,50.57 42.95,51.23 42.58,51.6 42.58,51.91 41.42,53.07 41.42,54.45 41.57,54.6 41.57,54.98 41.47,55.08 41.47,55.43 41.33,55.57 40.92,55.57 40.7,55.79 40.7,57.47 41.19,57.96 41.71,57.96 42.06,58.31 42.06,59.06 42.03,59.08 42.03,59.28 42.06,59.31 42.06,59.35 v1(42.36,59.65) ; 43.27,50.24 U37.11 ; 43.27,50.24 v1(42.78,49.75)
  Bottom Layer w0.203: R164.1 42.49,59.78 v1(42.36,59.65) ; v1(42.78,49.75) 38.8,45.78 29.33,45.78 28.5,46.6 CARD2.7
3V3_SOC_FLASH_MOSI: length 23.4
  Top Layer w0.203: U37.10 43.77,52 44.23,52.45 44.23,54.13 44.78,54.68 v1(44.78,54.7)
  Bottom Layer w0.203: v1(44.78,54.7) 44.58,54.9 43.9,54.9 R165.1 ; CARD2.3 32.9,46.78 33.6,46.08 36.76,46.08 38.47,47.8 38.47,49.46 39.34,50.33 43.28,50.33 v1(43.75,50.8)
3V3_TXD: length 5.8
  Top Layer w0.203: 47.07,40 47.03,39.95 v1(46.28,39.95) ; v1(42.99,40.12) 42.16,40.12 42.02,40.26 U6.8
  Bottom Layer w0.203: v1(46.28,39.95) 43.16,39.95 v1(42.99,40.12)
GND: length 266.1
  Top Layer w0.203: UART1.A1B12 17.94,55.51 UART1.1 ; C62.1 37.85,12.46 C60.1 C39.1 v2(39.77,12.46) C41.1 ; R154.1 57.7,55.76 57.33,56.13 U17.23 ; 40.41,34.66 40.26,34.81 40.26,36 40.23,36 ; 40.41,34.66 40.23,34.47 v2(40.01,34.47) ; 40.41,34.66 40.85,34.66 41,34.81 41,35.64 41.03,35.68 ; 45.97,31.75 45.97,32.16 C36.1 C53.1 45.82,34.05 45.82,34.7 ; UART1.2 10.42,56.08 UART1.B1A12 ; v2(52.37,48.46) 52.49,48.58 52.53,48.58 52.76,48.81 52.76,48.85 52.87,48.96 U17.8 ; 41.81,26.24 42.43,26.24 42.53,26.15 43.38,26.15 43.41,26.11 ; 26.63,14.53 26.63,15.86 ; 26.63,15.86 v2(26.7,15.93) ; 26.63,15.86 26.23,15.46 26.23,14.53 ; 43.41,27.31 43.38,27.28 42.53,27.28 42.5,27.25 42.01,27.25 ; 41.86,49.58 41.76,49.48 41.19,49.48 ; 30.43,58.71 30.43,60.71 ; 22.25,30.91 21.43,30.91 21.41,30.89 21.34,30.89 20.9,30.45 v2(20.22,30.45) 20.12,30.55 20.1,30.55 19.95,30.7 19.95,30.72 19.84,30.83 C42.1 C54.1 C69.1 19.84,33.51 22.94,36.6 23.31,36.6 24.47,37.76 25.67,37.76 C61.1 ; U9.3 51.48,37.05 51.48,37.41 51.88,37.81 U9.29 ; 38.63,14.53 38.63,15.78 38.23,16.18 ; 38.35,34.49 38.63,34.77 38.63,35.69 ; 22.25,24.51 23.21,24.51 23.45,24.76 23.45,25.5 ; 43.41,27.71 42.22,27.71 41.99,27.48 ; 37.03,14.53 37.03,16.1 37.19,16.26 v2(38.15,16.26) 38.23,16.18 ; 53.37,24.78 53.37,24.39 53.01,24.03 U29.2 ; U24.2 45.39,56.05 45.58,55.86 45.99,55.86 46.05,55.8 46.05,55.68 46.18,55.55 46.18,55.21 46.05,55.08 46.05,54.69 v2(45.91,54.55) ; 27.43,14.53 27.43,16.03 ; v1(44.58,32.24) 44.58,32.42 44.48,32.51 43.41,32.51 ; 41.91,18.57 42.51,18.57 42.53,18.55 43.38,18.55 43.41,18.51 ; 26.63,35.69 26.63,36.55 26.4,36.77 26.24,36.77 26.24,35.7 26.23,35.69 26.23,34.79 25.95,34.51 25.75,34.51 25.6,34.65 25.6,34.67 25.43,34.84 25.43,36.73 25.35,36.81 ; 32.23,35.69 32.23,36.55 32.59,36.91 ; 25.43,14.53 25.43,15.75 v2(25.63,15.95) 24.69,15.95 24.23,15.49 24.23,14.53 ; U6.2 42.52,37.24 42.45,37.17 41.64,37.17 41.33,37.48 41.33,37.97 ; C107.1 65.8,32.92 U27.4 ; C37.1 C68.1 C63.1 C52.1 C47.1 C65.1 23.93,12.2 ; C6.1 C8.1 C9.1 C7.1 ; U17.47 48.92,51.61 v2(49.33,52.02) ; U17.35 49.86,59.48 50.06,59.69 ; 43.41,18.11 41.86,18.11 ; 22.25,25.71 23.23,25.71 23.45,25.5 ; 22.25,32.51 22.25,32.91 ; 23.45,25.5 23.45,26.05 23.39,26.11 v2(20.06,26.11) 19.84,25.89 C64.1 C66.1 C44.1 ; 47.62,34.39 47.89,34.13 C84.2 ; 38.02,34.44 38.23,34.65 38.23,35.69 ; 38.23,16.18 38.23,14.53 ; 41.19,48.51 41.19,49.48 ; 41.19,49.48 41.09,49.48 ; v2(37.16,49.23) 37.48,48.9 R5.2 ; v1(29.39,39.12) 29.39,37.34 29.83,36.9 29.83,35.69 ; U26.2 U26.1 ; 40.92,38.61 40.92,38.95 v2(40.92,38.95) ; 25.78,37.92 25.78,37.93 27.33,37.93 ; C43.1 45.77,17.66 45.76,17.67 45.77,17.68 C56.1 ; v2(27.43,16.03) 27.83,15.63 27.83,14.53 ; C27.1 C29.1 ; 41.43,35.69 41.43,36.51 41.16,36.78 41.05,36.78 41.03,36.76 41.03,35.69
  Top Layer w0.254: v2(35.92,46.94) 35.94,46.96 40.06,46.96 41.13,48.04 C14.1
  Bottom Layer w0.203: R133.1 R134.1 64.94,21.12 v2(64.87,21.06) ; 70.89,29.29 70.86,29.31 CN6.87 CN6.14 ; 70.64,33.31 CN6.97 CN6.4 ; CN2.23 CN2.78 ; 41.81,47.04 41.8,47.05 C114.2 ; CN5.53 CN5.48 16.55,33.69 16.79,33.45 16.79,32.29 ; 16.79,32.29 16.59,32.49 CN5.45 13.23,32.49 ; 16.79,32.29 16.79,31.68 ; CN1.7 CN1.94 ; C109.2 5.21,27.6 ; 5.21,27.6 5.75,27.6 C108.2 ; 5.21,27.6 5.21,24.71 U39.15 5.93,23.93 U39.7 ; 16.79,31.68 16.79,29.13 16.54,28.88 15.61,28.88 CN5.36 CN5.65 v2(11.15,28.89) ; 16.79,31.68 16.42,32.04 15.65,32.04 CN5.44 CN5.57 ; CN5.22 CN5.79 12.04,23.29 11.69,22.94 RN2.4 RN2.3 RN2.2 RN2.1 ; CN2.3 CN2.98 41.71,8.11 41.45,7.85 40.69,7.85 40.51,8.03 CN2.95 CN2.6 ; v2(45.91,54.55) 45.91,53.45 v2(45.72,53.26) ; CN1.4 CN1.97 ; 45.64,39.42 46.69,39.42 ; 70.76,25.25 70.7,25.31 CN6.77 CN6.24 ; CN1.38 CN1.63 ; CN6.58 CN6.43 66.1,17.71 65.98,17.59 65.98,17.31 ; CN6.34 CN6.67 70.71,21.31 70.76,21.26 ; C112.2 61.4,56 61.24,56.16 ; CN2.37 CN2.64 ; CN5.29 CN5.72 11.94,26.09 11.91,26.06 ; CN6.56 CN6.45 66.24,16.91 65.98,17.18 65.98,17.31 ; D2.8 D2.3 81.25,39.34 v2(79.73,39.34) ; 70.74,31.29 70.72,31.31 CN6.92 CN6.9 ; CN6.29 v2(68.38,23.31) CN6.72 ; CN1.46 v2(40.92,38.95) CN1.55 ; C100.2 C101.2 ; CN2.8 CN2.93 ; v2(64.21,24.08) 64.81,24.08 R132.1 R131.1 ; C85.2 6.07,33.66 6.58,33.15 OSC5.2 ; C111.2 62.71,55.81 v2(62.71,56.11) ; CN1.17 CN1.84 ; CN1.16 CN1.85 ; CN1.1 CN1.100 ; RN1.1 RN1.2 RN1.3 RN1.4 ; 65.98,17.31 CN6.44 CN6.57 ; CN5.86 CN5.15 ; CN5.93 CN5.8 ; 26.24,36.63 26.52,36.91 CN1.10 26.52,40.3 ; CN1.13 CN1.88 ; CN1.24 CN1.77 32.12,41.54 32.05,41.61 ; CN6.19 CN6.82 ; CN2.44 CN2.57 ; CN2.16 CN2.85 ; CARD2.6 29.8,47.98 v1(29.8,48.9) ; CN1.31 CN1.70 ; CN2.7 CN2.94 ; CN2.30 CN2.71
  vias: v1(25.32,36.81) v2(14.73,43.79) v2(23.72,33.66) v2(27.3,60.96) v2(27.48,57.76) v2(29.62,45.29) v2(32.03,42.85) v2(37.18,43.06) v2(39.55,60.1) v2(41.86,49.6) v2(44.13,37.36) v2(45.36,34.44) v2(46,58.6) v2(46.08,46.05) v2(48.29,34.17) v2(48.79,48.36) v2(51,40.31) v2(51.03,38.61) v2(52.76,40.31) v2(52.78,38.63) v3(8.69,19.91) v3(16.05,7.09) v3(42.6,46.71) v3(43.27,46.73) v3(43.99,46.71) v3(46.53,41.88) v3(67.11,7.98)
VCC_0V9: length 104.3
  Top Layer w0.203: 27.03,35.69 27.03,36.58 26.57,37.04 26.57,37.38 25.78,37.38 ; 39.09,34.59 39.37,34.59 39.43,34.66 39.43,36.77 39.75,37.09 C57.2 C59.2 ; 39.09,34.59 38.19,33.69 37.7,33.69 37.38,33.37 37.38,32.88 36.3,31.8 v2(35.67,31.8) ; 39.09,34.59 38.95,34.74 38.95,34.76 39,34.81 39,35.66 39.03,35.69 ; 43.41,17.31 44.46,17.31 44.81,17.67 C58.2 45.21,18.44 C56.2 45.11,18.45 ; 22.25,25.31 21.1,25.31 20.9,25.51 C64.2 v1(20.39,25.1) C66.2 20.91,24.72 21.1,24.91 22.25,24.91 ; 45.11,18.45 44.38,17.71 43.41,17.71 ; 45.11,18.45 v2(44.7,18.45) ; 25.83,35.69 25.83,36.81 25.78,36.86 25.78,37.38 ; 22.25,31.71 20.43,31.71 C54.2 C69.2 ; 25.78,37.38 25.63,37.22 24.51,37.22 v2(23.53,36.24) ; C69.2 20.39,33.45 21.13,34.19 v2(22.02,34.19) ; C69.2 20.65,32.54 21.08,32.11 22.25,32.11 ; 28.23,14.53 28.23,13.48 27.79,13.04 27.79,12.75 27,12.75 ; 43.41,26.51 44.51,26.51 44.83,26.19 C51.2 C70.2 ; 25.83,14.53 25.83,13.39 26.21,13.01 26.21,12.75 v1(26.64,12.75) 27,12.75 ; v2(45.16,27.56) 45.17,27.55 C70.2 ; C70.2 44.63,26.98 44.55,26.91 43.42,26.91 43.41,26.91 ; 27,12.75 27,13.04 27.03,13.07 27.03,14.53 ; v2(44.73,34.44) 45.19,33.98 C53.2 ; 37.83,14.53 37.83,12.99 C62.2 v2(38.22,12.98) 38.58,12.98 C60.2 38.61,13.22 39.03,13.64 39.03,14.53 ; 43.41,33.31 45.04,33.31 C55.2 45.18,33.96 44.94,33.71 43.41,33.71 ; 24.63,14.53 24.63,12.77 24.61,12.75 24.59,12.78 v1(24.23,12.78)
  Top Layer w0.508: R6.1 v2(37.88,61.19) 38.3,61.61 v2(38.56,61.61) v2(39.37,61.61) 40.36,61.61
  Top Layer w0.6: U7.6 40.15,57.87 40.32,58.04 C6.2 C8.2 C9.2 40.32,61.61
  Inner2 w0.203: v2(22.02,34.19) 22.91,34.19 22.94,34.16 ; v2(44.7,18.45) 42.36,18.45 42.34,18.47 ; v1(24.23,12.78) 24.28,12.83 24.28,14.91 ; v2(44.73,34.44) 42.95,34.44 42.93,34.47 ; 22.63,35.69 22.97,35.69 v2(23.53,36.24) ; v2(45.16,27.56) 42.37,27.56 42.19,27.38 ; v2(38.22,12.98) 38.28,13.04 38.28,15.72 ; v1(20.39,25.1) 22.93,25.1 22.96,25.07 ; v1(26.64,12.75) 26.64,15.06
  Inner2 w1: v2(23.25,34.68) 17.15,40.78 17.15,49.95
  vias: v2(22.75,35.19)
VCC_1V8: length 382.9
  Top Layer w0.203: 43.08,35.9 43.35,35.63 44.5,35.63 45.08,36.2 45.08,37.45 v2(44.68,37.85) 44.68,38.84 R11.1 ; 43.08,35.9 C4.1 ; 43.08,35.9 43.08,35.43 42.15,34.5 42.15,33.23 42.47,32.91 44.73,32.91 44.89,32.76 45.11,32.76 45.19,32.67 C36.2 45.19,31.89 v1(45.13,31.83) ; 39.43,14.53 39.43,13.04 C39.2 C41.2 ; 28.63,14.53 28.63,12.81 28.58,12.75 29.08,12.75 ; U6.3 43.03,36.75 C4.1 ; v2(60.05,50.75) 62.92,53.62 v2(62.92,54.84) ; C4.1 41.67,36.7 41,37.38 C38.2 40.54,37.22 40.34,37.02 40.19,37.02 39.83,36.66 39.83,35.69 ; U37.1 41.52,45.48 41.35,45.65 v1(40.48,45.65) 40.48,43.7 39.29,42.52 L2.1 38.38,42.8 37.24,43.94 36.2,43.94 35.79,43.54 30.99,43.54 30.68,43.23 L1.1 31.57,42.45 31.9,42.12 31.9,39.48 31.65,39.23 C40.2 31.04,39.2 31.04,35.7 31.03,35.69 31.03,35.16 31,35.12 31,34.81 30.85,34.66 27.61,34.66 27.43,34.84 27.43,36.64 27.33,36.73 v1(27.33,36.9) 27.33,37.35 27.36,37.38 ; R168.1 73.61,23.33 74.02,23.75 U2.3 74.02,24.98 73.76,25.25 C102.2 72.31,25.6 v2(71.48,24.77) ; C41.2 40.18,13.22 39.83,13.57 39.83,14.53 ; C41.2 40.78,13.01 v1(40.8,13.03) ; R9.2 38.84,48.44 38.68,48.29 37.21,48.29 36.65,48.84 36.65,53.64 34.11,56.19 U10.6 ; 22.25,31.31 22.22,31.28 21.37,31.28 21.28,31.2 v2(21.01,31.2) 20.78,30.97 C42.2 ; v2(72.67,55.09) 72.73,55.15 U12.8 U12.7 74.12,57.07 75.23,58.18 v1(77.8,58.18) 77.96,58.34 U12.3 ; R129.2 47.35,31.39 v2(47.35,31.45) ; C44.2 20.78,23.93 v1(20.96,24.11) 22.25,24.11 ; v1(45.13,16.35) 45.22,16.44 C43.2 45.2,16.91 43.41,16.91 ; 48.06,26.66 48.06,26.03 46.93,24.9 ; v2(5.41,22.45) 6.73,23.77 v2(6.73,26.47) ; 25.03,13.35 v1(25.32,13.35) ; 25.03,13.35 25.03,12.98 25.25,12.75 25.42,12.75 ; 25.03,13.35 25.03,14.53 ; v2(74.6,5.31) 73.79,5.31 R172.2 62.32,5.37 R173.2 59.06,5.35 v2(56.64,7.77) ; 46.93,24.9 v1(45.08,24.9) 45.16,24.98 C45.2 44.72,25.41 44.42,25.71 43.41,25.71 ; 46.93,24.9 52.16,24.9 C110.2 52.28,24.42 52.5,24.2 U29.3 52.5,22.7 52.77,22.43 R170.1 55.44,22.43 v2(55.7,22.17)
  Top Layer w0.508: v2(5.41,22.45) 5.41,21.39 7.59,19.2 16.48,19.2 R34.2
  Top Layer w0.6: U10.6 33.62,57.3 C27.2 C29.2 C28.2 C26.2 33.59,61.73 v1(32.05,61.73) 31.63,61.3 v1(31.63,61.28) R17.1
  Inner2 w0.203: v2(71.48,24.77) 71.48,20.32 v2(71.53,20.27) ; 19.76,25.45 20.12,25.45 20.78,26.11
  Inner2 w1.016: 20.6,35.56 17.47,38.69 16.2,38.69 15.72,39.17 15.72,39.84 15.75,39.87 v2(15.75,49.94) 15.75,52.22 17.86,54.33 25.44,54.33 26.56,55.44 29.77,55.44 31.62,57.3 31.62,61.3 v1(32.05,61.73) ; v2(18.59,49.94) 18.59,41.25 22.3,37.54
  Bottom Layer w0.203: C49.2 15.62,43.23 v2(15.62,42.56) R38.1 ; C49.2 14.08,43.24 U3.6 ; C49.2 15.57,43.28 15.57,43.87 15.75,44.05 15.75,45.57 15.49,45.83 R37.1 ; v2(19.58,36.73) 18.39,37.92 12.06,37.92 10.36,36.22 ; R27.2 11.16,33.46 11.79,34.09 CN5.52 CN5.49 ; R27.2 R26.2 ; R27.2 10.69,32.16 ; v1(40.48,45.65) C113.1 44.99,45.65 45.52,46.18 R181.2 59.53,47.45 ; CN2.96 CN2.5 40.91,12.91 41.31,12.51 CN2.4 CN2.97 ; v1(45.13,31.83) 46.96,31.83 v2(47.35,31.45) ; R169.2 5.44,22.42 v2(5.41,22.45) ; 10.69,32.16 11.18,32.16 11.38,32.36 11.38,32.87 11.8,33.29 CN5.54 CN5.47 ; 10.69,32.16 10.69,30.87 ; 10.36,36.22 10.69,35.89 R26.2 ; 10.36,36.22 6.02,36.22 4.98,35.18 C85.1 4.98,33.91 4.38,33.3 OSC5.1 OSC5.4 4.38,29.8 6.33,27.85 C108.1 6.33,26.68 ; v2(6.73,26.47) 6.52,26.68 6.33,26.68 ; R26.2 11.58,34.73 11.82,34.49 CN5.51 CN5.50 ; CN5.46 CN5.55 12.26,32.89 11.73,32.36 11.73,31.5 11.11,30.87 10.69,30.87 ; 62.1,53.95 62.38,54.23 C111.1 62.83,54.93 v2(62.92,54.84) 63.73,54.84 63.96,54.61 67.62,54.61 67.64,54.59 67.98,54.59 67.99,54.61 72.19,54.61 v2(72.67,55.09) ; C74.2 77.75,58.13 v1(77.8,58.18) 78.7,58.18 R28.2 ; 6.33,26.68 6.08,26.43 U39.1 ; v2(74.6,5.31) 74.83,5.31 75.39,5.87 75.39,8.92 71.53,12.78 v2(71.53,20.27) ; v2(55.7,22.17) 55.7,8.71 v2(56.64,7.77) ; 10.69,30.87 R30.2 ; 41.51,13.03 42.14,13.03 42.51,12.65 CN2.1 CN2.100 ; 41.51,13.03 42.11,12.42 CN2.2 CN2.99 ; 41.51,13.03 v1(40.8,13.03) ; v2(60.05,50.75) 60.05,47.97 59.53,47.45 ; 59.53,47.45 60.25,47.45 61.62,48.82 R180.2
  Bottom Layer w1.016: v2(18.59,49.94) v2(15.75,49.94)
  vias: v1(29.07,12.75)
VCC_3V3: length 101.3
  Top Layer w0.203: v2(3.48,17.02) 3.48,16.42 R179.2 ; v2(69.75,45.03) 69.75,44.23 R160.1 ; U27.8 60.25,28.93 v1(61.73,28.93) ; v1(40.43,46.33) 41.3,46.33 41.52,46.55 U37.14 ; U29.7 53.01,19.92 53.44,19.48 R187.2 ; v2(49.25,59.64) 49.24,59.63 C97.1 48.28,58.28 C91.2 ; v2(70.31,54.03) 70.94,54.03 71.38,53.59 71.38,52.24 ; U17.24 57.47,56.63 v2(57.66,56.82) ; v2(45.57,44.42) 45.57,43.69 43.78,41.9 ; SW16.2 68.93,61.47 v2(68.99,61.42) ; 79.15,52.24 79.15,52.99 v2(79.25,53.09) ; v2(52.59,47.86) 53.17,47.86 53.37,48.06 C93.1 ; 43.78,41.9 44.53,41.9 44.91,41.52 C5.1 ; 43.78,41.9 43.03,41.9 42.52,41.4 U6.7 ; v2(4.01,22.35) 4.01,23.11 3.81,23.32 R178.2 ; 26.72,61.78 26.51,61.78 ; v2(45.77,60.86) 45.58,60.67 L3.2 43.24,60.67 42.9,60.33 42.9,57.95 43.13,57.73 43.5,57.73 43.82,57.41 43.82,56.47 43.4,56.05 U24.5 42.63,56.05 42.38,55.8 42.38,55.69 42.37,55.68 42.37,55.06 42.96,54.47 43.41,54.47 43.55,54.33 43.55,53.43 43.33,53.2 U25.5 ; U17.48 49.44,51.11 v2(49.58,51.26) ; 73.97,52.24 73.97,53.44 73.43,53.98 v2(72.75,53.98) ; 76.56,52.24 76.56,53.77 v2(76.51,53.82) ; SW14.2 65.54,61.47 v2(65.63,61.37) ; U26.8 60.23,22.18 v1(61.7,22.18) ; 27.88,61.78 27.88,60.4 27.15,59.68 R8.1
  Top Layer w0.254: LED12.2 10.95,9.39 10.88,9.32 ; v3(55.68,24.74) 55.46,24.52 R186.2 ; 13.71,9.32 R184.2 10.88,9.32 ; 13.71,9.32 13.73,9.34 LED11.2 ; 13.71,9.32 R183.2 16.87,9.32 ; LED10.2 16.51,9.68 16.87,9.32 ; 16.87,9.32 R182.2 18.92,9.32 19.29,9.69 LED9.2 ; 10.88,9.32 R185.2 v3(9.55,8.36) ; v3(56.57,19.91) 56.13,19.48 R187.2 ; C91.2 49.28,58.26 U17.36 ; U17.24 56.41,57.69 C88.1 ; U17.9 53.37,48.06 ; C94.1 47.82,50.09 U17.48
  Top Layer w0.381: U8.6 28.7,57.43 28.7,57.67 29.08,58.05 29.31,58.05 29.34,58.07 C10.2
  Top Layer w0.6: C10.2 C13.2 C12.2 C11.2 29.27,61.78 v2(28.3,61.78) v2(27.51,61.78) 26.72,61.78
  Bottom Layer w0.203: v2(64.31,25.43) 64.91,25.43 R130.1 ; U16.4 86.65,41.71 C87.2 ; U18.3 54.07,54.07 v2(54.05,54.05) ; v2(58.22,13.41) 58.22,14.13 58.33,14.24 59.55,14.24 R136.2 ; 48.87,55.34 48.87,56.61 48.48,57 48.02,57 47.72,56.69 47.38,56.69 47.08,57 v2(46.51,57) ; U39.14 4.15,26.7 C109.1 4.15,28.11 v2(4.06,28.19) ; v2(59.18,54.03) 59.26,53.95 U38.14 61.08,53.95 61.4,54.28 C112.1 61.68,54.93 61.87,55.12 v2(61.87,56.16) ; C105.1 62.42,28.93 v1(61.73,28.93) ; v1(61.7,22.18) 62.31,22.18 C104.2 62.33,22.15 v2(62.33,21.23) ; v1(40.43,46.33) 40.6,46.5 C114.1
VCC_5V: length 165
  Top Layer w0.203: R24.1 56.56,34.73 v1(56.4,34.58) ; v1(75.75,20.25) 74.75,20.25 74.75,20.66 74.53,20.87 U2.7
  Top Layer w0.508: U33.33 U33.35 U33.37 U33.39 80.7,1.41 81.14,1.85 PS1.4
  Top Layer w0.6: R19.2 32.79,48.27 32.07,47.55 ; U10.3 33.9,51.05 33.9,48.47 ; 33.9,48.47 C31.2 ; 33.9,48.47 32.99,47.55 ; U11.2 21.75,58.74 C19.2 21.75,48.98 23.18,47.55 26.17,47.55 ; 32.07,47.55 27.34,47.55 ; 32.07,47.55 32.99,47.55 ; U8.3 27.87,51.05 27.87,49.47 ; 32.99,47.55 v1(39.63,47.55) 40.04,47.96 40.04,51.15 U7.3 ; 27.34,47.55 27.87,48.08 C17.2 27.87,49.47 ; 27.34,47.55 26.17,47.55 ; 27.87,49.47 C16.2 ; R10.2 26.76,48.14 26.17,47.55
  Inner2 w0.203: v1(39.63,47.55) 39.63,42.29 42.89,39.02 44.2,39.02 45.43,37.79 45.43,37.44 45.49,37.38 45.49,36.42 47.34,34.58 v1(56.4,34.58) 56.4,21.32 61.22,16.5 v1(66.05,16.5) 68.88,19.33 74.83,19.33 v1(75.75,20.25) 76.46,20.25 PS1.4
  Bottom Layer w0.203: CN6.55 CN6.46 66.07,16.51 v1(66.05,16.5)
B35_L1_N: length 16
  Top Layer w0.203: v1(41.4,31.43) 41.52,31.31 43.41,31.31
  Bottom Layer w0.203: v1(41.4,31.43) 41.4,30.97 41.17,30.74 40.72,30.74 40.59,30.87 40.34,30.87 40.11,31.1 40.11,31.63 40.25,31.78 40.95,31.78 41.1,31.92 41.1,32.23 40.95,32.38 40.25,32.38 40.11,32.52 40.11,32.83 40.25,32.98 40.95,32.98 41.1,33.12 41.1,33.43 40.95,33.58 40.25,33.58 40.11,33.72 40.11,34.04 40.12,34.05 40.16,34.05 40.28,34.18 40.95,34.18 41.1,34.32 41.1,34.63 40.95,34.78 40.28,34.78 39.9,35.15 39.9,36.24 39.72,36.42 CN1.43
B35_L1_P: length 15.7
  Top Layer w0.203: 41.57,33.64 41.47,33.75 40.95,33.75 40.85,33.84 40.85,34.15 40.96,34.26 41.44,34.26 41.56,34.39 41.56,34.55 ; 43.41,31.71 43.38,31.75 41.74,31.75 41.58,31.91 40.36,31.91 40.19,32.08 40.19,32.23 40.38,32.42 41.38,32.42 41.58,32.62 41.58,32.74 41.44,32.89 40.43,32.89 40.23,33.09 40.23,33.21 40.35,33.33 41.47,33.33 41.58,33.45 41.58,33.64 ; 41.57,34.55 v1(41.56,34.56)
  Bottom Layer w0.203: v1(41.56,34.56) 41.56,35.03 41.16,35.43 40.95,35.43 40.63,35.11 40.43,35.11 40.21,35.33 40.21,35.54 40.53,35.86 40.53,36.06 40.21,36.38 40.21,37.11 40.12,37.19 CN1.44
B35_L2_N: length 15.7
  Top Layer w0.203: 43.41,29.71 43.38,29.75 42.53,29.75 42.51,29.76 v1(42.14,29.76)
  Bottom Layer w0.203: v1(42.14,29.76) 40.73,29.76 40.59,29.61 40.59,29.54 40.44,29.39 40.13,29.39 39.99,29.54 39.99,29.61 39.84,29.76 39.36,29.76 39.01,30.11 38.81,30.11 38.76,30.07 38.56,30.07 38.34,30.29 38.34,30.49 38.38,30.53 38.38,30.74 38.12,31 38.12,31.53 37.98,31.67 37.83,31.67 37.69,31.81 37.69,32.13 37.83,32.27 37.98,32.27 38.12,32.41 38.12,32.73 37.98,32.87 37.83,32.87 37.69,33.01 37.69,33.33 37.83,33.47 37.98,33.47 38.12,33.61 38.12,33.93 37.98,34.07 37.83,34.07 37.69,34.21 37.69,34.53 37.83,34.67 37.98,34.67 38.12,34.81 38.12,35.13 37.98,35.27 37.83,35.27 37.69,35.41 37.69,35.73 37.83,35.87 37.98,35.87 38.12,36.01 CN1.39
B35_L2_P: length 15.6
  Top Layer w0.203: v1(38.61,31.17) 38.58,31.14 38.58,29.96 38.71,29.83 38.99,29.83 39.19,30.03 39.19,30.31 39.34,30.46 39.65,30.46 39.73,30.39 39.73,29.89 40.01,29.6 40.13,29.6 40.27,29.75 40.27,30.11 40.42,30.26 40.73,30.26 40.87,30.11 40.87,29.75 41.02,29.6 41.34,29.6 41.95,30.22 42.33,30.22 42.43,30.11 43.41,30.11
  Bottom Layer w0.203: CN1.40 38.52,33.75 38.76,33.51 38.76,33.15 38.52,32.91 38.52,32.55 38.76,32.31 38.76,31.95 38.61,31.79 v1(38.61,31.17)
B35_L4_N: length 15.7
  Top Layer w0.203: 43.41,30.51 42.46,30.51 42.45,30.52 41.82,30.52 41.82,30.52 v1(41.6,30.52)
  Bottom Layer w0.203: CN1.41 38.92,36.27 39.07,36.13 39.15,36.13 39.29,35.99 39.29,35.67 39.15,35.53 39.07,35.53 38.92,35.39 38.92,35.07 39.07,34.93 39.15,34.93 39.29,34.79 39.29,34.47 39.15,34.33 39.07,34.33 38.92,34.19 38.92,33.8 39.13,33.6 39.13,33.07 39.27,32.93 39.66,32.93 39.8,32.78 39.8,32.47 39.66,32.33 39.27,32.33 39.13,32.18 39.13,31.87 39.27,31.73 39.66,31.73 39.8,31.58 39.8,31.27 39.66,31.13 39.27,31.13 39.13,30.98 39.13,30.48 39.54,30.06 39.76,30.06 39.9,30.21 39.9,30.42 40.05,30.56 40.36,30.56 40.5,30.42 40.5,30.21 40.65,30.06 41.15,30.06 v1(41.6,30.52)
B35_L4_P: length 15.7
  Top Layer w0.203: 43.41,30.91 43.39,30.89 42.11,30.89 42.03,30.98 39.82,30.98 39.57,31.23 39.57,31.45 39.42,31.59 38.84,31.59 38.7,31.73 38.7,32.05 38.84,32.19 39.42,32.19 39.57,32.33 39.57,32.65 39.42,32.79 37.83,32.79 37.68,32.93 37.68,33.25 37.83,33.39 39.42,33.39 39.57,33.53 v1(39.57,33.81)
  Bottom Layer w0.203: CN1.42 39.32,36.74 39.32,36.74 39.32,36.39 39.6,36.11 39.6,34.35 39.57,34.31 v1(39.57,33.81)
B35_L5_N: length 15.7
  Top Layer w0.203: v1(41.17,28) 41.95,28 42.06,28.11 43.41,28.11
  Bottom Layer w0.203: v1(41.17,28) 38.89,28 36.12,30.76 CN1.34
B35_L5_P: length 15.7
  Top Layer w0.203: v1(41.61,28.46) 42.29,28.46 42.35,28.51 43.41,28.51
  Bottom Layer w0.203: CN1.35 36.52,30.79 38.86,28.46 39.1,28.46 39.24,28.6 39.24,28.64 39.39,28.78 39.7,28.78 39.84,28.64 39.84,28.6 39.99,28.46 40.3,28.46 40.44,28.6 40.44,28.64 40.59,28.78 40.9,28.78 41.04,28.64 41.04,28.6 41.19,28.46 v1(41.61,28.46)
B35_L6_N: length 15.7
  Top Layer w0.203: 43.41,28.91 43.41,28.92 41.21,28.92 41.07,28.77 41.07,28.57 40.92,28.43 40.61,28.43 40.47,28.57 40.47,28.77 40.32,28.92 40.01,28.92 39.87,28.77 39.87,28.57 39.72,28.43 39.41,28.43 39.27,28.57 39.27,28.77 39.12,28.92 39.11,28.92 v1(38.96,29.06)
  Bottom Layer w0.203: v1(38.96,29.06) 38.68,29.06 36.92,30.82 CN1.36
